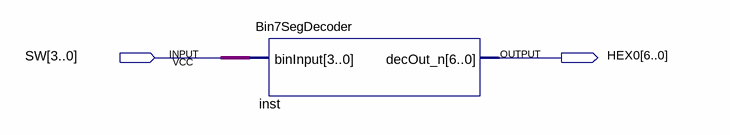
[diagram p0: schematic sheet]
// Quartus schematic DisplayDemo.bdf as structural Verilog: 1 symbols, 2 pins
module DisplayDemo (
  input  [3:0] SW,
  output [6:0] HEX0
);

  Bin7SegDecoder inst (.binInput(SW), .decOut_n(HEX0));
endmodule
